# Altium schematic sheet carte_fusee.SchDoc
size A3; SheetNumber: 1; SheetTotal: 1; SPICEModelCacheQPCIMDSC: <root> / <DocumentId>QPCIMDSC</DocumentId> / <CacheFrame Number="0"> / <Model Name="led0" Kind="MDL"> / <Text>*Typ INFRARED GaAs LED: Vf=1.2V Vr=5V If=40mA trr=3uS / *LED Pinout: 1=A, 2=K / .MODEL LED0 D (IS=93.5P RS=84M N=2.63 BV=5 IBV=10U / + CJO=2.97P VJ=.75 M=.333 TT=4.32U)</Text> / </Model> / <Model Name="spdtrelay" Kind="CKT"> / <Text>*Generic SPDT Relay / *Connections:     COM / *                 | NC / *                 | | NO / *                 | | | T1 / *                 | | | | T2 / *                 | | | | | / .SUBCKT SPDTRELAY 1 2 3 4 5 / + PARAMS: PULLIN=4 DROPOFF=0.1 CONTACT=1m RESISTANCE=500 INDUCTANCE=10m / L1 4 6 {(INDUCTANCE/2)} / L2 5 7 {(INDUCTANCE/2)} / R1 6 7 {RESISTANCE} / BNO 8 0 V={PULLIN}-abs(v(6,7)) / SW1 2 1 8 0 SWNC ON / BNC 9 0 V=abs(v(6,7)) / SW2 3 1 9 0 SWNO OFF / .MODEL SWNC SW(VT={DROPOFF} RON={CONTACT} ) / .MODEL SWNO SW(VT={(PULLIN*0.98)} RON={CONTACT} ) / .ENDS SPDTRELAY</Text> / </Model> / <Model Name="diode" Kind="MDL"> / <Text>*Default Diode / *Diode Pinout: A,K / .MODEL DIODE D()</Text> / </Model> / <Model Name="2n3904" Kind="MDL"> / <Text>*2N3904 / *Si 310mW  40V 200mA 300MHz pkg:TO-92B 1,2,3 / .MODEL 2N3904 NPN(IS=1.4E-14 BF=300 VAF=100 IKF=0.025 ISE=3E-13 / + BR=7.5 RC=2.4 CJE=4.5E-12 TF=4E-10 CJC=3.5E-12 TR=2.1E-8 XTB=1.5 KF=9E-16 )</Text> / </Model> / </CacheFrame> / </root>
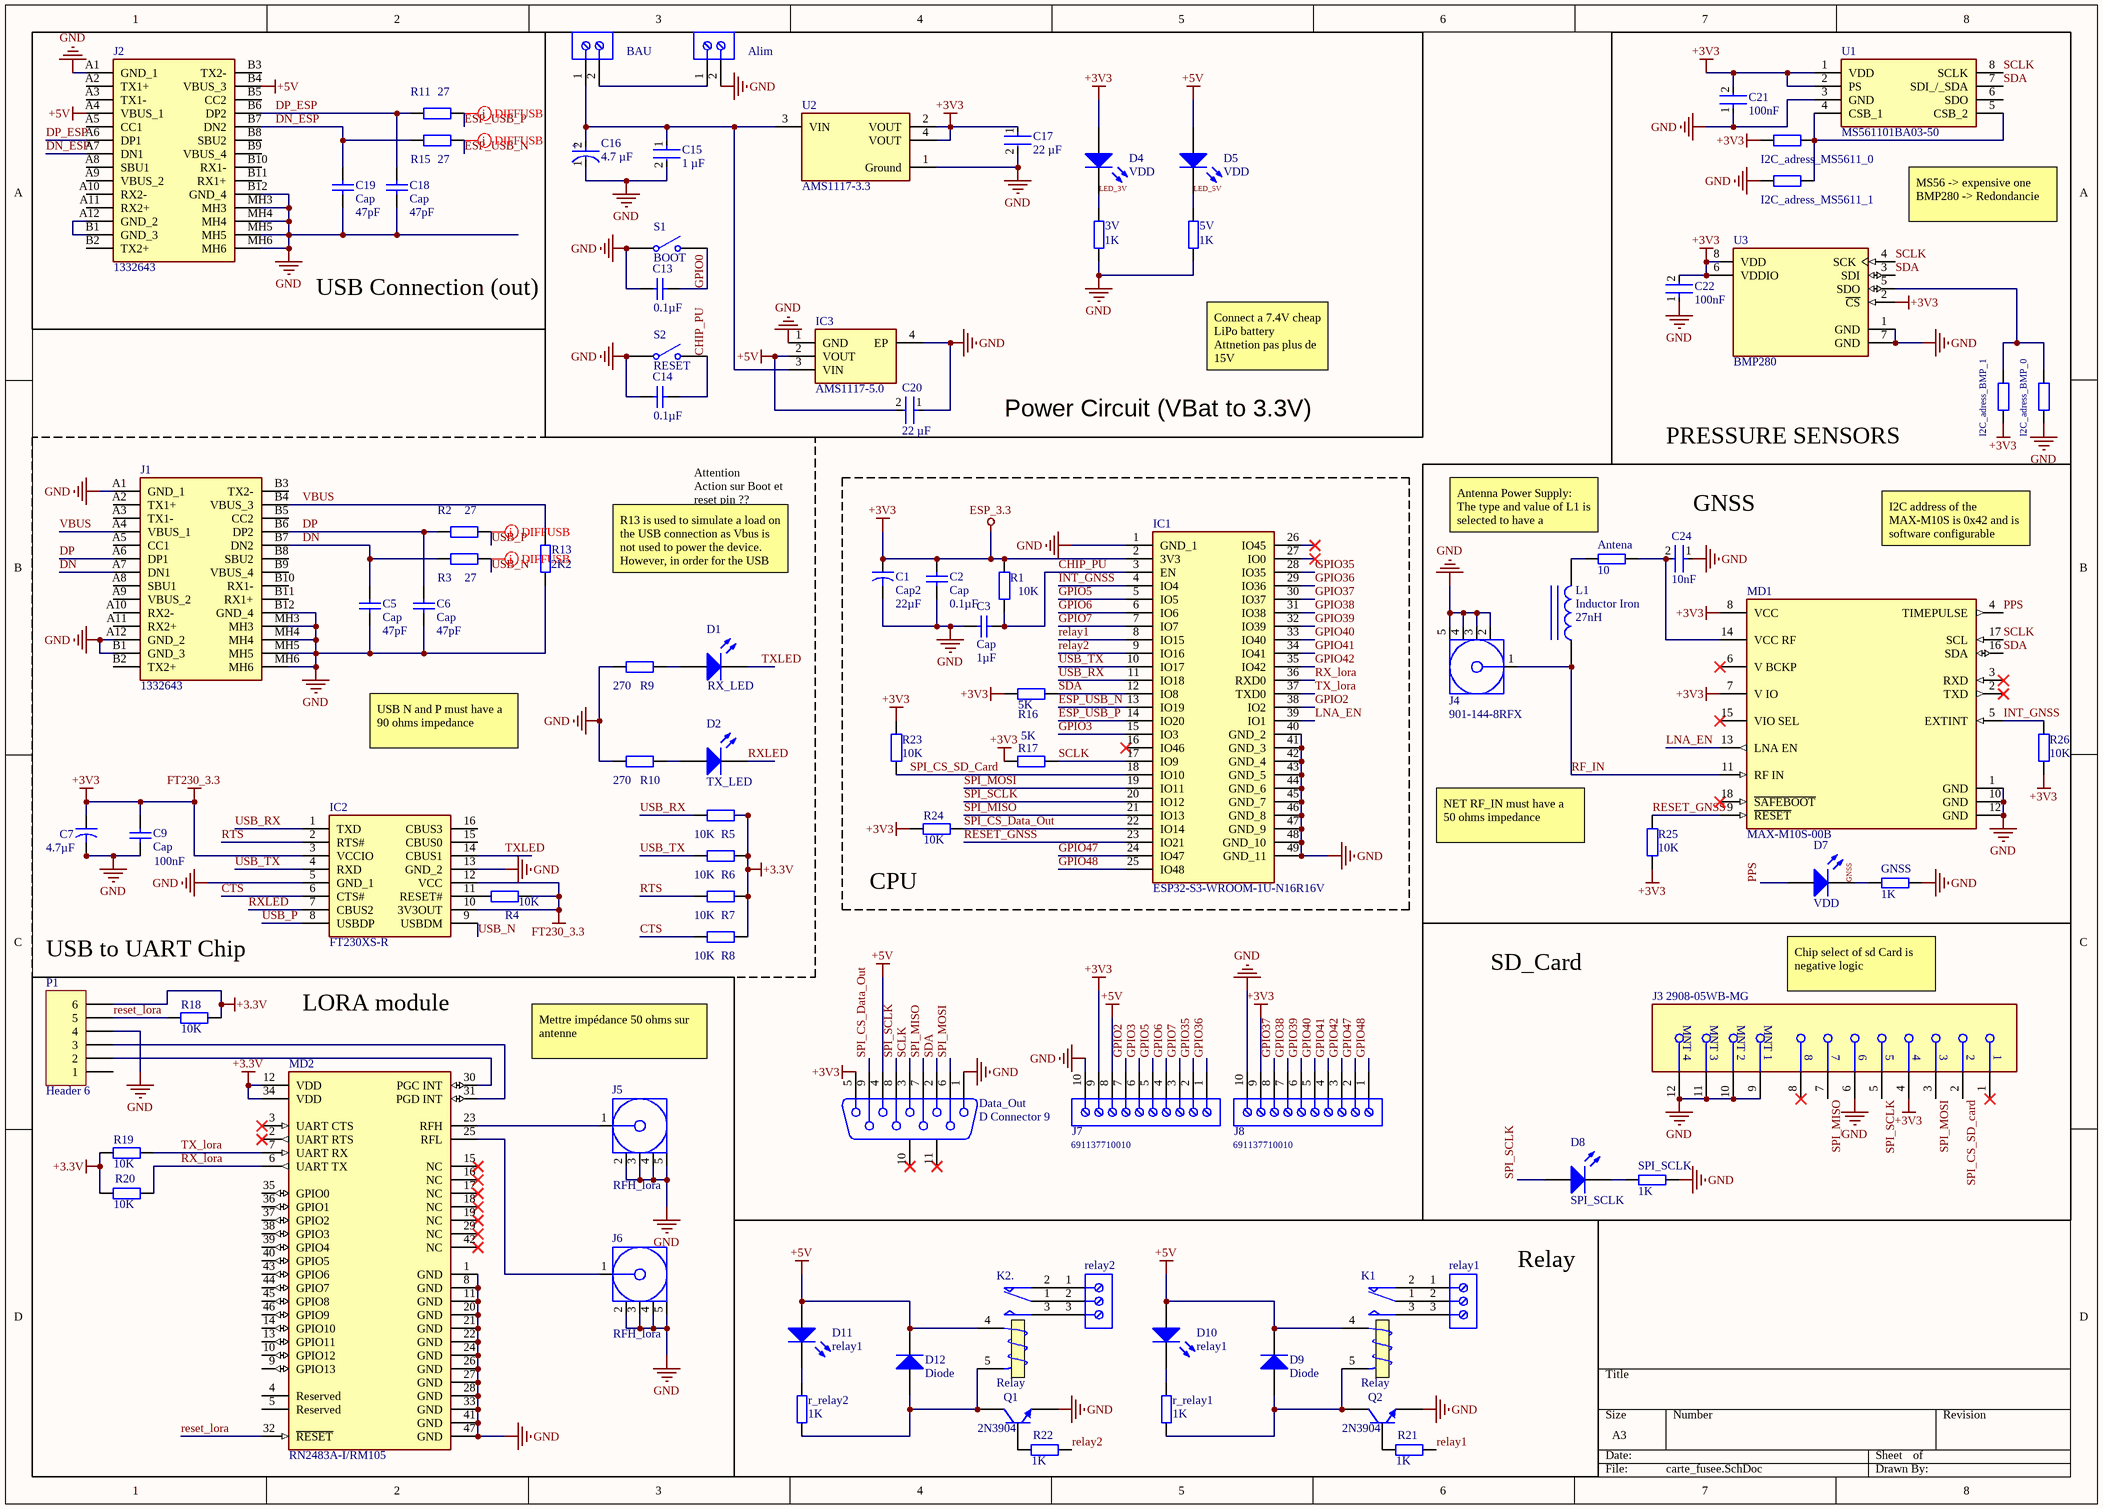
[diagram p0: carte_fusee.SchDoc]

## Parts
3V  1K  [RES_0402]
5V  1K  [RES_0402]
Alim  Alim  [691137710002]  (value not drawn)
Antena  10  [RES_0402]
BAU  BAU  [691137710002]  (value not drawn)
C1  Cap2  value 22µF  [Capacitor 2.5]
C2  Cap  value 0.1µF  [Capacitor 1206]
C3  Cap  value 1µF  [Capacitor 1206]
C5  Cap  value 47pF  [Capacitor 1206]
C6  Cap  value 47pF  [Capacitor 1206]
C7  value 4.7µF  [Capacitor]  (hidden comment: Cap2)
C9  Cap  value 100nF  [Capacitor 1206]
C13  value 0.1µF  [Capacitor 1206]  (hidden comment: Cap)
C14  value 0.1µF  [Capacitor 1206]  (hidden comment: Cap)
C15  1 µF  [FP-CL10-IPC_A]
C16  4.7 µF  [FP-FKB-MFG]
C17  22 µF  [FP-CL10-IPC_A]
C18  Cap  value 47pF  [Capacitor 1206]
C19  Cap  value 47pF  [Capacitor 1206]
C20  22 µF  [FP-CL10-IPC_A]
C21  100nF  [FP-CL10-IPC_A]
C22  100nF  [FP-CL10-IPC_A]
C24  10nF  [FP-CL10-IPC_A]
D1  RX_LED  [LED-0]
D2  TX_LED  [LED-0]
D4  VDD  [LED-0]
D5  VDD  [LED-0]
D7  VDD  [LED-0]
D8  SPI_SCLK  [LED-0]
D9  Diode  [SMC]
D10  relay1  [LED-0]
D11  relay1  [LED-0]
D12  Diode  [SMC]
Data_Out  D Connector 9  [DSUB1.385-2H9]
GNSS  1K  [RES_0402]
I2C_adress_BMP_0  Res2  [Resistor 1206]  (value not drawn)
I2C_adress_BMP_1  Res2  [Resistor 1206]  (value not drawn)
I2C_adress_MS5611_0  Res2  [Resistor 1206]  (value not drawn)
I2C_adress_MS5611_1  Res2  [Resistor 1206]  (value not drawn)
IC1  ESP32-S3-WROOM-1U-N16R16V  [ESP32S3WROOM1UN16]
IC2  FT230XS-R  [SOP64P599X175-16N]
IC3  AMS1117-5.0  [SOT290P700X180-4N]
J1  1332643  [1332643]
J2  1332643  [1332643]
J3  2908-05WB-MG  [FP-2908-05WB-MG-MFG]
J4  901-144-8RFX  [AMPH-901-144-8RFX_V]
J5  RFH_lora  [AMPH-901-144-8RFX_V]
J6  RFH_lora  [AMPH-901-144-8RFX_V]
J7  691137710010  [691137710010]
J8  691137710010  [691137710010]
K1  Relay  [MODULE5B]
K2.  Relay  [MODULE5B]
L1  Inductor Iron  value 27nH  [AXIAL-0.9]
MD1  MAX-M10S-00B  [FP-MAX-M10S-00B-MFG]
MD2  RN2483A-I/RM105  [FP-RN2483A-I-RM105-MFG]
P1  Header 6  [HDR1X6]
Q1  2N3904  [TO-92A]
Q2  2N3904  [TO-92A]
R1  value 10K  [Resistor 1206]  (hidden comment: Res2)
R2  value 27  [Resistor 1206]  (hidden comment: Res2)
R3  value 27  [Resistor 1206]  (hidden comment: Res2)
R4  value 10K  [Resistor 1206]  (hidden comment: Res2)
R5  value 10K  [Resistor 1206]  (hidden comment: Res2)
R6  value 10K  [Resistor 1206]  (hidden comment: Res2)
R7  value 10K  [Resistor 1206]  (hidden comment: Res2)
R8  value 10K  [Resistor 1206]  (hidden comment: Res2)
R9  value 270  [Resistor 1206]  (hidden comment: Res2)
R10  value 270  [Resistor 1206]  (hidden comment: Res2)
R11  value 27  [Resistor 1206]  (hidden comment: Res2)
R13  2K2  [RES_0402]
R15  value 27  [Resistor 1206]  (hidden comment: Res2)
R16  value 5K  [Resistor 1206]  (hidden comment: Res2)
R17  value 5K  [Resistor 1206]  (hidden comment: Res2)
R18  value 10K  [Resistor 1206]  (hidden comment: Res2)
R19  value 10K  [Resistor 1206]  (hidden comment: Res2)
R20  value 10K  [Resistor 1206]  (hidden comment: Res2)
R21  value 1K  [Resistor 1206]  (hidden comment: Res2)
R22  value 1K  [Resistor 1206]  (hidden comment: Res2)
R23  value 10K  [Resistor 1206]  (hidden comment: Res2)
R24  value 10K  [Resistor 1206]  (hidden comment: Res2)
R25  value 10K  [Resistor 1206]  (hidden comment: Res2)
R26  value 10K  [Resistor 1206]  (hidden comment: Res2)
r_relay1  1K  [RES_0402]
r_relay2  1K  [RES_0402]
relay1  691137710003  [691137710003]  (value not drawn)
relay2  691137710003  [691137710003]  (value not drawn)
S1  BOOT  [SPST-2]
S2  RESET  [SPST-2]
SPI_SCLK  1K  [RES_0402]
U1  MS561101BA03-50  [MS561101BA0350]
U2  AMS1117-3.3  [FP-AMS1117-IPC_C]
U3  BMP280  [FP-BMP280-MFG]

## Blocks framed on the sheet
USB Connection (out): C18 C19 J2 R11 R15
Power Circuit (VBat to 3.3V): 3V 5V Alim BAU C13-C17 C20 D4 D5 IC3 S1 S2 U2
PRESSURE SENSORS: C21 C22 I2C_adress_BMP_0 I2C_adress_BMP_1 I2C_adress_MS5611_0 I2C_adress_MS5611_1 U1 U3
USB to UART Chip: C5-C7 C9 D1 D2 IC2 J1 R2-R10 R13
CPU: C1-C3 IC1 R1 R16 R17 R23 R24
GNSS: Antena C24 D7 GNSS J4 L1 MD1 R25 R26
SD_Card: D8 J3 SPI_SCLK
Relay: D9-D12 K1 K2. Q1 Q2 R21 R22 r_relay1 r_relay2 relay1 relay2

## Nets
+3.3V: MD2.12(VDD) MD2.34(VDD) P1.6 R5.1 R6.1 R7.1 R8.1 R18.2 R19.1 R20.1
+3V3: C1.1 C2.2 C7.1 C9.2 C17.1 C21.2 C22.2 D4.1(A) Data_Out.5 I2C_adress_BMP_1.1 I2C_adress_MS5611_0.1 IC1.2(3V3) IC2.3(VCCIO) IC2.10(3V3OUT) IC2.12(VCC) J3.4 J7.9 J8.9 MD1.7(V_IO) MD1.8(VCC) R1.2 R4.1 R16.2 R17.2 R23.1 R24.2 R25.2 R26.2 U1.1(VDD) U1.2(PS) U2.2(VOUT) U2.4(VOUT) U3.2(~{CS}) U3.6(VDDIO) U3.8(VDD)  [also labelled ESP_3.3, FT230_3.3]
+5V: C20.2 D5.1(A) D9.2(K) D10.1(A) D11.1(A) D12.2(K) Data_Out.4 IC3.2(VOUT) J2.A4(VBUS_1) J2.B4(VBUS_3) J7.8 K1.4(T1) K2..4(T1)
GND: 3V.1 5V.1 Alim.2 C1.2 C2.1 C3.1 C5.1 C6.1 C7.2 C9.1 C13.2 C14.2 C15.2 C16.1(C) C17.2 C18.1 C19.1 C20.1 C21.1 C22.1 C24.1 Data_Out.1 GNSS.1 I2C_adress_BMP_0.1 I2C_adress_MS5611_1.1 IC1.1(GND_1) IC1.40(GND_2) IC1.41(GND_3) IC1.42(GND_4) IC1.43(GND_5) IC1.44(GND_6) IC1.45(GND_7) IC1.46(GND_8) IC1.47(GND_9) IC1.48(GND_10) IC1.49(GND_11) IC2.5(GND_1) IC2.13(GND_2) IC3.1(GND) IC3.4(EP) J1.A1(GND_1) J1.A12(GND_2) J1.B1(GND_3) J1.B12(GND_4) J1.MH3 J1.MH4 J1.MH5 J1.MH6 J2.A1(GND_1) J2.B12(GND_4) J2.MH3 J2.MH4 J2.MH5 J2.MH6 J3.6 J3.9(MNT_1) J3.10(MNT_2) J3.11(MNT_3) J3.12(MNT_4) J4.2 J4.3 J4.4 J4.5 J5.2 J5.3 J5.4 J5.5 J6.2 J6.3 J6.4 J6.5 J7.10 J8.10 MD1.1(GND) MD1.10(GND) MD1.12(GND) MD2.1(GND) MD2.8(GND) MD2.11(GND) MD2.20(GND) MD2.21(GND) MD2.22(GND) MD2.24(GND) MD2.26(GND) MD2.27(GND) MD2.28(GND) MD2.33(GND) MD2.41(GND) MD2.47(GND) P1.4 Q1.1(E) Q2.1(E) R9.2 R10.2 R13.1 S1.1(COMMON) S2.1(COMMON) SPI_SCLK.1 U1.3(GND) U2.1(Ground) U3.1(GND) U3.7(GND)
CHIP_PU: C3.2 C14.1 IC1.3(EN) R1.1 S2.2(NO)
CTS: IC2.6(CTS#) R8.2
DN: C5.2 J1.A7(DN1) J1.B7(DN2) R3.1
DN_ESP: C19.2 J2.A7(DN1) J2.B7(DN2) R15.1
DP: C6.2 J1.A6(DP1) J1.B6(DP2) R2.2
DP_ESP: C18.2 J2.A6(DP1) J2.B6(DP2) R11.2
ESP_USB_N: IC1.13(IO19) R15.2
ESP_USB_P: IC1.14(IO20) R11.1
GNSS: D7.2(K) GNSS.2
GPIO0: C13.1 S1.2(NO)
GPIO2: IC1.38(IO2) J7.7
GPIO3: IC1.15(IO3) J7.6
GPIO5: IC1.5(IO5) J7.5
GPIO6: IC1.6(IO6) J7.4
GPIO7: IC1.7(IO7) J7.3
GPIO35: IC1.28(IO35) J7.2
GPIO36: IC1.29(IO36) J7.1
GPIO37: IC1.30(IO37) J8.8
GPIO38: IC1.31(IO38) J8.7
GPIO39: IC1.32(IO39) J8.6
GPIO40: IC1.33(IO40) J8.5
GPIO41: IC1.34(IO41) J8.4
GPIO42: IC1.35(IO42) J8.3
GPIO47: IC1.24(IO47) J8.2
GPIO48: IC1.25(IO48) J8.1
INT_GNSS: IC1.4(IO4) MD1.5(EXTINT) R26.1
LED_3V: 3V.2 D4.2(K)
LED_5V: 5V.2 D5.2(K)
LNA_EN: IC1.39(IO1) MD1.13(LNA_EN)
PPS: D7.1(A) MD1.4(TIMEPULSE)
relay1: IC1.8(IO15) R21.2
relay2: IC1.9(IO16) R22.2
RESET_GNSS: IC1.23(IO21) MD1.9(~{RESET}) R25.1
reset_lora: MD2.32(~{RESET}) P1.5 R18.1
RF_IN: J4.1 L1.1 MD1.11(RF_IN)
RTS: IC2.2(RTS#) R7.2
RX_lora: IC1.36(RXD0) MD2.6(UART_TX) R20.2
RXLED: D2.2(K) IC2.7(CBUS2)
SCLK: Data_Out.3 IC1.17(IO9) MD1.17(SCL) R17.1 U1.8(SCLK) U3.4(SCK)
SDA: Data_Out.2 IC1.12(IO8) MD1.16(SDA) R16.1 U1.7(SDI_/_SDA) U3.3(SDI)
SPI_CS_Data_Out: Data_Out.9 IC1.22(IO14) R24.1
SPI_CS_SD_card: IC1.18(IO10) J3.2 R23.2
SPI_MISO: Data_Out.7 IC1.21(IO13) J3.7
SPI_MOSI: Data_Out.6 IC1.19(IO11) J3.3
SPI_SCLK: D8.1(A) Data_Out.8 IC1.20(IO12) J3.5
TX_lora: IC1.37(TXD0) MD2.7(UART_RX) R19.2
TXLED: D1.2(K) IC2.14(CBUS1)
USB_N: IC2.9(USBDM) R3.2
USB_P: IC2.8(USBDP) R2.1
USB_RX: IC1.11(IO18) IC2.1(TXD) R5.2
USB_TX: IC1.10(IO17) IC2.4(RXD) R6.2
VBUS: J1.A4(VBUS_1) J1.B4(VBUS_3) R13.2
NetAlim_1: Alim.1 BAU.2
NetAntena_1: Antena.1 C24.2 MD1.14(VCC_RF)
NetAntena_2: Antena.2 L1.2
NetBAU_1: BAU.1 C15.1 C16.2(A) IC3.3(VIN) U2.3(VIN)
NetD1_1: D1.1(A) R9.1
NetD2_1: D2.1(A) R10.1
NetD8_2: D8.2(K) SPI_SCLK.2
NetD9_1: D9.1(A) K1.5(T2) Q2.3(C) r_relay1.1
NetD10_2: D10.2(K) r_relay1.2
NetD11_2: D11.2(K) r_relay2.2
NetD12_1: D12.1(A) K2..5(T2) Q1.3(C) r_relay2.1
NetI2C_adress_BMP_0_2: I2C_adress_BMP_0.2 I2C_adress_BMP_1.2 U3.5(SDO)
NetI2C_adress_MS5611_0_2: I2C_adress_MS5611_0.2 I2C_adress_MS5611_1.2 U1.4(CSB_1) U1.5(CSB_2)
NetIC2_11: IC2.11(RESET#) R4.2
NetJ2_A12: J2.A12(GND_2) J2.B1(GND_3)
NetJ5_1: J5.1 MD2.23(RFH)
NetJ6_1: J6.1 MD2.25(RFL)
NetK1_1: K1.1(COM) relay1.2
NetK1_2: K1.2(NC) relay1.1
NetK1_3: K1.3(NO) relay1.3
NetK2._1: K2..1(COM) relay2.2
NetK2._2: K2..2(NC) relay2.1
NetK2._3: K2..3(NO) relay2.3
NetMD2_30: MD2.30(PGC_INT) P1.2
NetMD2_31: MD2.31(PGD_INT) P1.3
NetQ1_2: Q1.2(B) R22.1
NetQ2_2: Q2.2(B) R21.1

Not connected (* = marked no-connect by the designer): Data_Out 10(MH1)* 11(MH2)*; IC1 16(IO46)* 26(IO45)* 27(IO0)*; IC2 15(CBUS0) 16(CBUS3); J1 A2(TX1+) A3(TX1-) A5(CC1) A8(SBU1) A9(VBUS_2) A10(RX2-) A11(RX2+) B2(TX2+) B3(TX2-) B5(CC2) B8(SBU2) B9(VBUS_4) B10(RX1-) B11(RX1+); J2 A2(TX1+) A3(TX1-) A5(CC1) A8(SBU1) A9(VBUS_2) A10(RX2-) A11(RX2+) B2(TX2+) B3(TX2-) B5(CC2) B8(SBU2) B9(VBUS_4) B10(RX1-) B11(RX1+); J3 1* 8*; MD1 2(TXD)* 3(RXD)* 6(V_BCKP)* 15(VIO_SEL)* 18(~{SAFEBOOT})*; MD2 2(UART_RTS)* 3(UART_CTS)* 4(Reserved) 5(Reserved) 9(GPIO13) 10(GPIO12) 13(GPIO11) 14(GPIO10) 15(NC)* 16(NC)* 17(NC)* 18(NC)* 19(NC)* 29(NC)* 35(GPIO0) 36(GPIO1) 37(GPIO2) 38(GPIO3) 39(GPIO4) 40(GPIO5) 42(NC)* 43(GPIO6) 44(GPIO7) 45(GPIO8) 46(GPIO9); P1 1; U1 6(SDO)

## Layout directives
differential pair: ESP_USB_N, ESP_USB_P, USB_N, USB_P

## Notes on the sheet
- MS56 -> expensive one
  BMP280 -> Redondancie
- Connect a 7.4V cheap LiPo battery
  Attnetion pas plus de 15V
- R13 is used to simulate a load on the USB connection as Vbus is not used to power the device. However, in order for the USB protocol to work, there must be some current drawn over Vbus
- (near Antena) Antenna Power Supply:
  The type and value of L1 is selected to have a resonance peak at GNSS frequencies. This provides a high series impedance above 500 Ω at GNSS L1 frequencies, creating an impedance mismatch with respect to the 50 Ω RF signal line.
  Value of resisitance, inductance and capacitance are the standart values proposed in the datasheet
- I2C address of the MAX-M10S is 0x42 and is software configurable
- Attention
  Action sur Boot et reset pin ??
- USB N and P must have a 90 ohms impedance
- NET RF_IN must have a 50 ohms impedance
- Chip select of sd Card is negative logic
- LORA module
- Mettre impédance 50 ohms sur antenne
- (in symbol CMP-00287-05404361-1) +

## Library data of the parts
3V 5V Antena GNSS R13 r_relay1 r_relay2 SPI_SCLK = RES_0402: Resistor SMD 0402; Manufacturer: *; Manufacturer Part Number: *; Distributor Link: *; LCSC: *
Alim BAU = CMP-1502-03324-2: NexarPartId: 78871135; Voltage Rating: 300V; Number of Contacts: 2; Current Rating: 16A; Lead Pitch: 5mm; Height: 11.6mm; Packaging: Box; RoHS: Non-Compliant; Contact Material: Nickel, Tin; Max Operating Temperature: 120°C; Number of Pins: 2; Min Operating Temperature: -30°C; Number of Rows: 1
C1 C7 = Cap2: Capacitor; Published: 23-Sep-2002; PackageReference: CAPR5-4X5; Publisher: Altium Limited; PackageDescription: Capacitor; 2 Leads
C2 C3 C5 C6 C9 C13 C14 C18 C19 = Cap: Capacitor; Published: 8-Jun-2000; LatestRevisionDate: 17-Jul-2002; LatestRevisionNote: Re-released for DXP Platform.; PackageReference: RAD-0.3; Publisher: Altium Limited; PackageDescription: Radial Cap, Thru-Hole; 2 Leads; 0.3 in Pin Spacing
C15 C17 C20-C22 C24 = CMP-13271-001457-1: Cap Ceramic 1uF 16V X5R ±10% Pad SMD 0603 +85°C T/R; Dielectric: X5R; Height: 0.8mm; Capacitance: 1uF; Mount: Surface Mount; Thickness: 0.035inch; Width: 0.031inch; Min Operating Temperature: -55°C; Contact Plating: Tin; Case Code (Imperial): 0603; Depth: 0.8mm; Length: 1.6mm; Max Operating Temperature: 85°C; Packaging: Tape and Reel; Tolerance: 10%; Radiation Hardening: No; Case/Package: 0603; Package Quantity: 1; Voltage Rating: 16V; Case Code (Metric): 1608; Voltage: 16V; Material: Ceramic; Lead Free: Lead Free; Voltage Rating (DC): 16V
C16 = CMP-00287-05404361-1: EEEFK1H4R7R Aluminum Electrolytic Capacitor, 4.7 uF, 50 V, ± 20%, 2000 hours @ 105°C, Radial Can - SMD; Polarity: Polar; Impedance: 2.9Ω; Ripple Current (AC): 60mA; Leakage Current: 3µA; Material: Aluminium; Voltage Rating (AC): 50V; Lead Diameter: 650µm; Capacitance: 4.7µF; Number of Pins: 2; Lead Pitch: 1mm; Height: 5.8mm; Life (Hours): 2000hours; REACH SVHC: No SVHC; Case/Package: Radial; Height - Seated (Max): 6.096mm; Tolerance: 20%; Packaging: Cut Tape; Min Operating Temperature: -55°C; Radiation Hardening: No; Ripple Current: 60mA; Lifecycle Status: Production; Width: 5.5mm; Termination: SMD/SMT; Dielectric Material: Aluminium; Voltage: 50V; Voltage Rating (DC): 50V; Schedule B: 8532220020, 8532220020; Mount: PCB, Surface Mount; RoHS: Compliant; Max Operating Temperature: 105°C; Voltage Rating: 50V; Lead Free: Lead Free; Diameter: 4mm; Length: 5.8mm; ESR (Equivalent Series Resistance): 2.9Ω; NexarPartId: 5404361
D1 D2 D4 D5 D7 D8 D10 D11 = LED0: Typical INFRARED GaAs LED; Published: 8-Jun-2000; LatestRevisionDate: 08-Jul-2005; LatestRevisionNote: Mech Layer 1 removed.; PackageReference: LED-0; Publisher: Altium Limited; PackageDescription: LED; 2 Leads
D9 D12 = Diode: Default Diode; Published: 8-Jun-2000; LatestRevisionDate: 17-Jul-2002; LatestRevisionNote: Re-released for DXP Platform.; PackageVersion: Sep-1996; PackageReference: SMC; Publisher: Altium Limited; PackageDescription: DO-214-AB/SMC; 2 C-Bend Leads; Body 7.9 x 5.9 mm, inc. leads (LxW); Code_JEDEC: DO-214-AB
Data_Out = D Connector 9: Receptacle Assembly, 9 Position, Right Angle; PackageDocument: O; Positions: 9; Published: 15-Jun-2001; LatestRevisionDate: 17-Jul-2002; LatestRevisionNote: Re-released for DXP Platform.; DatasheetDocument: 1-Sep-1999; PackageReference: 788750; Publisher: Altium Limited; Orientation: Right Angle; Gender: Receptacle
I2C_adress_BMP_0 I2C_adress_BMP_1 I2C_adress_MS5611_0 I2C_adress_MS5611_1 R1-R11 R15-R26 = Res2: Resistor; Published: 8-Jun-2000; LatestRevisionDate: 17-Jul-2002; LatestRevisionNote: Re-released for DXP Platform.; PackageReference: AXIAL-0.4; Publisher: Altium Limited; PackageDescription: Axial Device, Thru-Hole; 2 Leads; 0.4 in Pin Spacing
IC1 = ESP32-S3-WROOM-1U-N16: Integrated Circuit; Manufacturer_Name: Espressif Systems; Datasheet Link: https://www.espressif.com/sites/default/files/documentation/esp32-s3-wroom-1_wroom-1u_datasheet_en.pdf; Height: 3.35mm; Manufacturer_Part_Number: ESP32-S3-WROOM-1U-N16; Mouser Part Number: 356-ESP32S3WROM1UN16; Mouser Price/Stock: https://www.mouser.co.uk/ProductDetail/Espressif-Systems/ESP32-S3-WROOM-1U-N16?qs=Li%252BoUPsLEntAI1ynUyotnA%3D%3D
IC2 = FT230XS-R: Integrated Circuit; Manufacturer_Name: FTDI(Future Designs); Datasheet Link: https://ftdichip.com/wp-content/uploads/2021/10/DS_FT230X.pdf; Height: 1.753mm; Manufacturer_Part_Number: FT230XS-R
IC3 = AMS1117-5.0: Integrated Circuit; Manufacturer_Name: Shikues; Datasheet Link: https://datasheet.lcsc.com/szlcsc/SK-AMS1117-5-0_C165483.pdf; Height: 1.8mm; Manufacturer_Part_Number: AMS1117-5.0
J1 J2 = 1332643: Connector; Manufacturer_Name: Phoenix Contact; Datasheet Link: http://www.phoenixcontact.com/de/produkte/1332643; Height: 3.31mm; Manufacturer_Part_Number: 1332643; Mouser Part Number: 651-1332643; Mouser Price/Stock: https://www.mouser.co.uk/ProductDetail/Phoenix-Contact/1332643?qs=Znm5pLBrcAJhPoOCsTWMGg%3D%3D; Arrow Part Number: 1332643; Arrow Price/Stock: https://www.arrow.com/en/products/1332643/phoenix-contact?region=nac
J3 = CMP-2000-05030-2: CONN MICRO SD CARD PUSH-PUSH R/A; Gender: Male; Number of Positions: 8; Connector Type: Connector; Pitch: 1.1mm; Body Material: Thermoplastic; Current Rating: 500mA; Number of Contacts: 8; Depth: 15.2mm; Length: 14mm; Termination: Solder; Package Quantity: 3000; Lead Free: Lead Free; Flammability Rating: UL94 V-0; Width: 1.85mm; Series: 2900; Packaging: Tape and Reel; Orientation: Right Angle; Min Operating Temperature: -25°C; Mount: Surface Mount; Contact Plating: Gold; Radiation Hardening: No; Contact Material: Copper Alloy; Number of Rows: 1; Max Operating Temperature: 85°C; Features: Shielded; Max Current Rating: 500mA; Housing Material: Thermoplastic
J4-J6 = CMP-2000-05706-1: Coaxial Connector, 18 GHz, 50 Ohm, -65 to 165 degC, 5-Pin THD, RoHS, Bulk; Manufacturer: Amphenol; Contact Termination: Solder; Dielectric Material: Polytetrafluoroethylene(PTFE); Frequency - Max: 18GHz; Body Material: Brass; Other Names: 901-144-8-RFX9011448RFXARFX1231; Center Contact Plating: Gold; Connector Type: Jack,FemaleSocket; Center Contact Material: BerylliumCopper; Impedance: 50Ohm; 3D Model: 901-144-8RFX.igs; Online Catalog: SMA,RFX; Connector Style: SMA; Category: Connectors,Interconnects; Housing Color: Gold; Mounting Type: ThroughHole; Ingress Protection: -; Packaging: Bulk; Features: -; Fastening Type: Threaded; Series: -; Standard Package: 1; Shield Termination: Solder; Mounting Technology: SurfaceMount; Family: CoaxialConnectors(RF); Package Reference: 901-144-8RFX; Datasheet URL: https://datasheet.ciiva.com/23676/c901-144-8rfx-23676337.pdf; Package Description: 5-Pin Through Hole Device, Body 7 x 7 mm, Pitch 2.54 mm; Cable Group: -; Datasheet Version: Rev. A, 01/2001; Body Finish: Gold; Operating Temperature: -65°C~165°C; Voltage Rating: -; Manufacturer URL: http://www.amphenol.com/
J7 J8 = CMP-1502-03331-1: Series 1377 - 5.00 mm Horizontal Entry with Pressure Clamp WR-TBL, 10 pin; Manufacturer: Wurth Elektronik; Pin Number: 10; Pitch: 5.00mm; Mounting Technology: THT; Part Number: 691137710010; Packaging: Box; Package Reference: 691137710010; Manufacturer URL: http://www.we-online.de; Datasheet URL: http://katalog.we-online.de/pbs/datasheet/691137710010.pdf; Publisher: WurthElektronik; Operating Temperature: -30to120degC
K1 K2. = Relay: SPDT Relay; Published: 8-Jun-2000; LatestRevisionDate: 17-Jul-2002; LatestRevisionNote: Re-released for DXP Platform.; PackageReference: MODULE5B; Publisher: Altium Limited
L1 = Inductor Iron: Magnetic-Core Inductor; Published: 24-Mar-1999; LatestRevisionDate: 17-Jul-2002; LatestRevisionNote: Re-released for DXP Platform.; PackageReference: AXIAL-0.9; Publisher: Altium Limited; PackageDescription: Axial Device, Thru-Hole; 2 Leads; 0.9 in Pin Spacing
MD1 = CMP-207130-000026-1: GNSS LCC RX, ROM, TCXO, LNA, SAW
MD2 = CMP-06331-000016-1: LORA TRANSCEIVER MODULE 868MHZ; Manufacturer: Microchip; Min Supply Voltage: 2.1V; Bandwidth: 1.74MHz; Sensitivity: -146dBm; Max Frequency: 870MHz; Transmitting Current: 44.5mA; Interface: UART; Number Of Gpio: 14; Max Supply Voltage: 3.6V; Data Rate: 300kbits/s; Number Of Adc Channels: 13; Device Class L1: Integrated Circuits (ICs); Automotive: No; Temperature: -40°C to +85°C; Device Class L3: Transceivers; Mouser Description: RF Transceiver Module FSK/GFSK/LoRa 433MHz and 868MHz 2.1V to 3.6V SMD Tray; Device Class L2: RF Semiconductors and Devices; Package: 0; ComponentLink2Description: Datasheet; Temperature Range High: +85°C; Octopart: https://octopart.com/rn2483a-i%2Frm105-microchip-96092210; Digikey Description: LORA TRANSCEIVER MODULE 868MHZ; Temperature Range Low: -40°C; Height: 3.467mm; ComponentLink2URL: http://ww1.microchip.com/downloads/en/DeviceDoc/RN2483-Low-Power-Long-Range-LoRa-Technology-Transceiver-Module-Data-Sheet-DS50002346D.pdf; Category: UNK; RoHS: TRUE; Lead Free: Yes; Manufacturer Part Number: RN2483A-I/RM105
P1 = Header 6: Header, 6-Pin; LatestRevisionDate: 17-Jul-2002; LatestRevisionNote: Re-released for DXP Platform.; Publisher: Altium Limited
Q1 Q2 = 2N3904: NPN General Purpose Amplifier; Published: 8-Jun-2000; LatestRevisionDate: 15-Jan-2003; LatestRevisionNote: PCB Footprint 'BCY-W3/D4.7' replaced; DatasheetVersion: 1997; PackageVersion: Sep-1998; PackageReference: TO-92A; Publisher: Altium Limited; PackageDescription: TO, Flat Index; 3 In-Line, Axial Leads; Body Dia. 4.5mm; Leads 0.51 x 0.48 mm (max); ComponentLink1Description: Manufacturer Link; ComponentLink1URL: http://www.fairchildsemi.com/; ComponentLink2Description: Datasheet; ComponentLink2URL: http://www.fairchildsemi.com/ds/2N%2F2N3904.pdf
relay1 relay2 = CMP-1502-03325-2: NexarPartId: 78871138; Number of Pins: 3; Packaging: Box; RoHS: Non-Compliant; Lead Pitch: 5mm
S1 S2 = SW-SPST: Single-Pole, Single-Throw Switch; Published: 24-Mar-1999; LatestRevisionDate: 17-Jul-2002; LatestRevisionNote: Re-released for DXP Platform.; PackageReference: SPST-2; Publisher: Altium Limited; PackageDescription: Switch; 2 Leads
U1 = MS561101BA03-50: Undefined or Miscellaneous; Manufacturer_Name: Mikroe; Datasheet Link: https://www.te.com/commerce/DocumentDelivery/DDEController?Action=showdoc&DocId=Data+Sheet%7FMS5611-01BA03%7FB3%7Fpdf%7FEnglish%7FENG_DS_MS5611-01BA03_B3.pdf%7FMS561101BA03-50; Height: 1.05mm; Manufacturer_Part_Number: MS561101BA03-50
U2 = CMP-209535-000001-1: LDO Voltage Regulators 1A, 3.3V; Manufacturer: Advanced Monolithic Systems; Dropout Voltage: 1.1V; Output Type: Fixed; Nominal Supply Current: 5mA; Max Power Dissipation: 1.2W; Max Supply Voltage: 15V; Number Of Outputs: 1; Standoff Height: 0.64mm; Max Junction Temp: +125°C; Height: 1.8mm; Package: AMS1117; Device Class L2: Power Management ICs; ComponentLink2Description: Datasheet; ComponentLink2URL: http://www.advanced-monolithic.com/pdf/ds1117.pdf; Category: IC; RoHS: TRUE; Automotive: No; Device Class L1: Integrated Circuits (ICs); Output Current: 1A; Device Class L3: Voltage Regulators - Linear; Temperature: -40°C to +125°C; Output Voltage: 3.3V; Manufacturer Part Number: AMS1117-3.3; Temperature Range Low: -40°C; Octopart: https://octopart.com/ams1117-3.3-advanced+monolithic+systems-25899300; Lead Free: Yes; Ipc Land Pattern Name: SOT229P700X180-4; Temperature Range High: +125°C
U3 = CMP-2000-05076-3: SENSOR PRESSURE ABS; Operating Pressure: 15.95PSI; Pressure Type: Absolute; Output Type: SPI; Max Pressure: 290.08PSI; Port Style: No Port; Case/Package: SMD/SMT; Lead Free: Lead Free; Termination: SMD/SMT; Min Operating Temperature: -40°C; Number of Pins: 8; Max Operating Temperature: 85°C